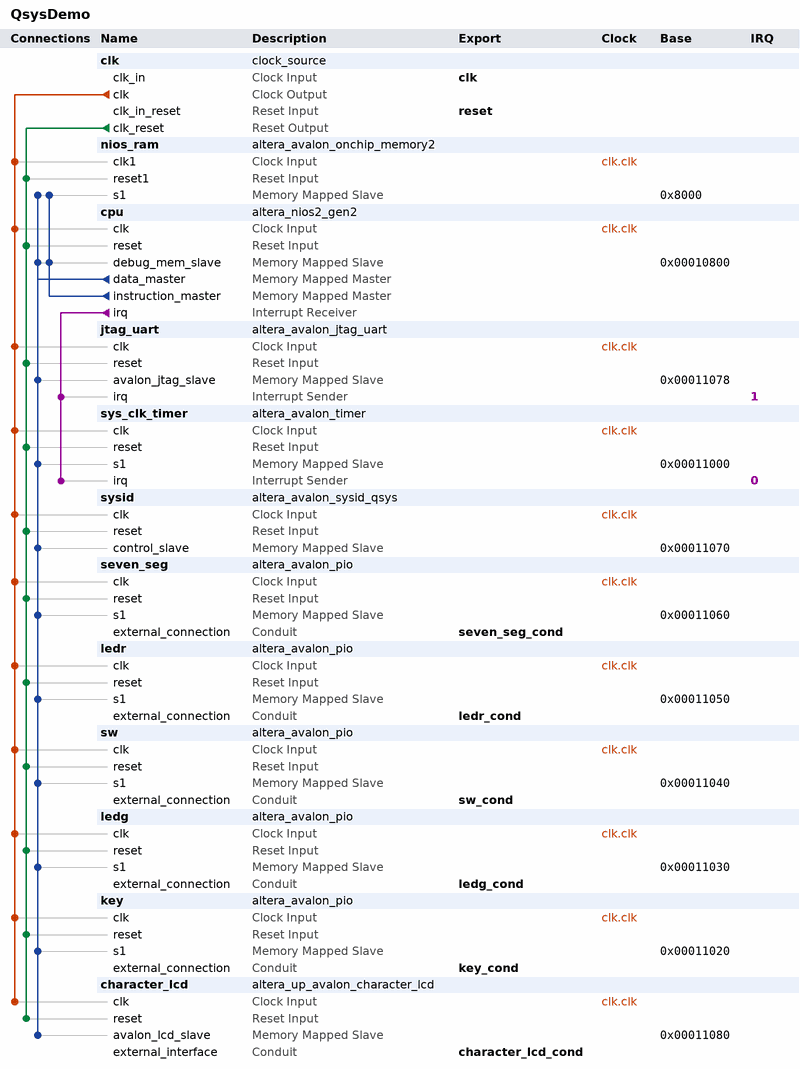
[diagram p0: system contents]
# Platform Designer (Qsys) system QsysDemo, Cyclone IV E EP4CE115F29C7
# Parameters at their usual value, and those the tool derives, are not listed.
package require -exact qsys 15.1
create_system QsysDemo
set_project_property DEVICE_FAMILY {Cyclone IV E}
set_project_property DEVICE EP4CE115F29C7

add_instance clk clock_source 15.1
set_instance_parameter_value clk clockFrequency 50000000

add_instance nios_ram altera_avalon_onchip_memory2 15.1
set_instance_parameter_value nios_ram dataWidth 32
set_instance_parameter_value nios_ram dualPort false
set_instance_parameter_value nios_ram initMemContent true
set_instance_parameter_value nios_ram initializationFileName onchip_mem.hex
set_instance_parameter_value nios_ram memorySize 20480

add_instance cpu altera_nios2_gen2 15.1
set_instance_parameter_value cpu dcache_size 2048
set_instance_parameter_value cpu exceptionSlave nios_ram.s1
set_instance_parameter_value cpu icache_size 4096
set_instance_parameter_value cpu impl Tiny
set_instance_parameter_value cpu resetSlave nios_ram.s1

add_instance jtag_uart altera_avalon_jtag_uart 15.1
set_instance_parameter_value jtag_uart simInteractiveOptions NO_INTERACTIVE_WINDOWS

add_instance sys_clk_timer altera_avalon_timer 15.1
set_instance_parameter_value sys_clk_timer period 1
set_instance_parameter_value sys_clk_timer periodUnits MSEC

add_instance sysid altera_avalon_sysid_qsys 15.1
set_instance_parameter_value sysid id 0

add_instance seven_seg altera_avalon_pio 15.1
set_instance_parameter_value seven_seg direction Output
set_instance_parameter_value seven_seg width 32

add_instance ledr altera_avalon_pio 15.1
set_instance_parameter_value ledr direction Output
set_instance_parameter_value ledr width 18

add_instance sw altera_avalon_pio 15.1
set_instance_parameter_value sw direction Input
set_instance_parameter_value sw width 18

add_instance ledg altera_avalon_pio 15.1
set_instance_parameter_value ledg direction Output
set_instance_parameter_value ledg width 9

add_instance key altera_avalon_pio 15.1
set_instance_parameter_value key direction Input
set_instance_parameter_value key width 4

add_instance character_lcd altera_up_avalon_character_lcd 15.1
set_instance_parameter_value character_lcd cursor Normal

# connections
add_connection clk.clk character_lcd.clk clock
add_connection clk.clk cpu.clk clock
add_connection clk.clk jtag_uart.clk clock
add_connection clk.clk key.clk clock
add_connection clk.clk ledg.clk clock
add_connection clk.clk ledr.clk clock
add_connection clk.clk nios_ram.clk1 clock
add_connection clk.clk seven_seg.clk clock
add_connection clk.clk sw.clk clock
add_connection clk.clk sys_clk_timer.clk clock
add_connection clk.clk sysid.clk clock
add_connection clk.clk_reset character_lcd.reset reset
add_connection clk.clk_reset cpu.reset reset
add_connection clk.clk_reset jtag_uart.reset reset
add_connection clk.clk_reset key.reset reset
add_connection clk.clk_reset ledg.reset reset
add_connection clk.clk_reset ledr.reset reset
add_connection clk.clk_reset nios_ram.reset1 reset
add_connection clk.clk_reset seven_seg.reset reset
add_connection clk.clk_reset sw.reset reset
add_connection clk.clk_reset sys_clk_timer.reset reset
add_connection clk.clk_reset sysid.reset reset
add_connection cpu.data_master character_lcd.avalon_lcd_slave avalon
set_connection_parameter_value cpu.data_master/character_lcd.avalon_lcd_slave baseAddress 0x00011080
add_connection cpu.data_master cpu.debug_mem_slave avalon
set_connection_parameter_value cpu.data_master/cpu.debug_mem_slave baseAddress 0x00010800
add_connection cpu.data_master jtag_uart.avalon_jtag_slave avalon
set_connection_parameter_value cpu.data_master/jtag_uart.avalon_jtag_slave baseAddress 0x00011078
add_connection cpu.data_master key.s1 avalon
set_connection_parameter_value cpu.data_master/key.s1 baseAddress 0x00011020
add_connection cpu.data_master ledg.s1 avalon
set_connection_parameter_value cpu.data_master/ledg.s1 baseAddress 0x00011030
add_connection cpu.data_master ledr.s1 avalon
set_connection_parameter_value cpu.data_master/ledr.s1 baseAddress 0x00011050
add_connection cpu.data_master nios_ram.s1 avalon
set_connection_parameter_value cpu.data_master/nios_ram.s1 baseAddress 0x8000
add_connection cpu.data_master seven_seg.s1 avalon
set_connection_parameter_value cpu.data_master/seven_seg.s1 baseAddress 0x00011060
add_connection cpu.data_master sw.s1 avalon
set_connection_parameter_value cpu.data_master/sw.s1 baseAddress 0x00011040
add_connection cpu.data_master sys_clk_timer.s1 avalon
set_connection_parameter_value cpu.data_master/sys_clk_timer.s1 baseAddress 0x00011000
add_connection cpu.data_master sysid.control_slave avalon
set_connection_parameter_value cpu.data_master/sysid.control_slave baseAddress 0x00011070
add_connection cpu.instruction_master cpu.debug_mem_slave avalon
set_connection_parameter_value cpu.instruction_master/cpu.debug_mem_slave baseAddress 0x00010800
add_connection cpu.instruction_master nios_ram.s1 avalon
set_connection_parameter_value cpu.instruction_master/nios_ram.s1 baseAddress 0x8000
add_connection cpu.irq jtag_uart.irq interrupt
set_connection_parameter_value cpu.irq/jtag_uart.irq irqNumber 1
add_connection cpu.irq sys_clk_timer.irq interrupt
set_connection_parameter_value cpu.irq/sys_clk_timer.irq irqNumber 0

# exported interfaces
add_interface character_lcd_cond conduit end
set_interface_property character_lcd_cond EXPORT_OF character_lcd.external_interface
add_interface clk clock sink
set_interface_property clk EXPORT_OF clk.clk_in
add_interface key_cond conduit end
set_interface_property key_cond EXPORT_OF key.external_connection
add_interface ledg_cond conduit end
set_interface_property ledg_cond EXPORT_OF ledg.external_connection
add_interface ledr_cond conduit end
set_interface_property ledr_cond EXPORT_OF ledr.external_connection
add_interface reset reset sink
set_interface_property reset EXPORT_OF clk.clk_in_reset
add_interface seven_seg_cond conduit end
set_interface_property seven_seg_cond EXPORT_OF seven_seg.external_connection
add_interface sw_cond conduit end
set_interface_property sw_cond EXPORT_OF sw.external_connection

set_interconnect_requirement {$system} qsys_mm.clockCrossingAdapter HANDSHAKE
set_interconnect_requirement {$system} qsys_mm.enableEccProtection FALSE
set_interconnect_requirement {$system} qsys_mm.insertDefaultSlave FALSE
set_interconnect_requirement {$system} qsys_mm.maxAdditionalLatency 1

save_system QsysDemo.qsys
